# Altium schematic sheet blocking.SchDoc
size A4; CompanyName: Technische Hochschule Nürnberg Georg Simon Ohm; Address1: Fürther Straße 250; Address2: 90429 Nürnberg; Address3: GERMANY; SheetNumber: 10; SheetTotal: 21; CompanyName2: Institut ELSYS
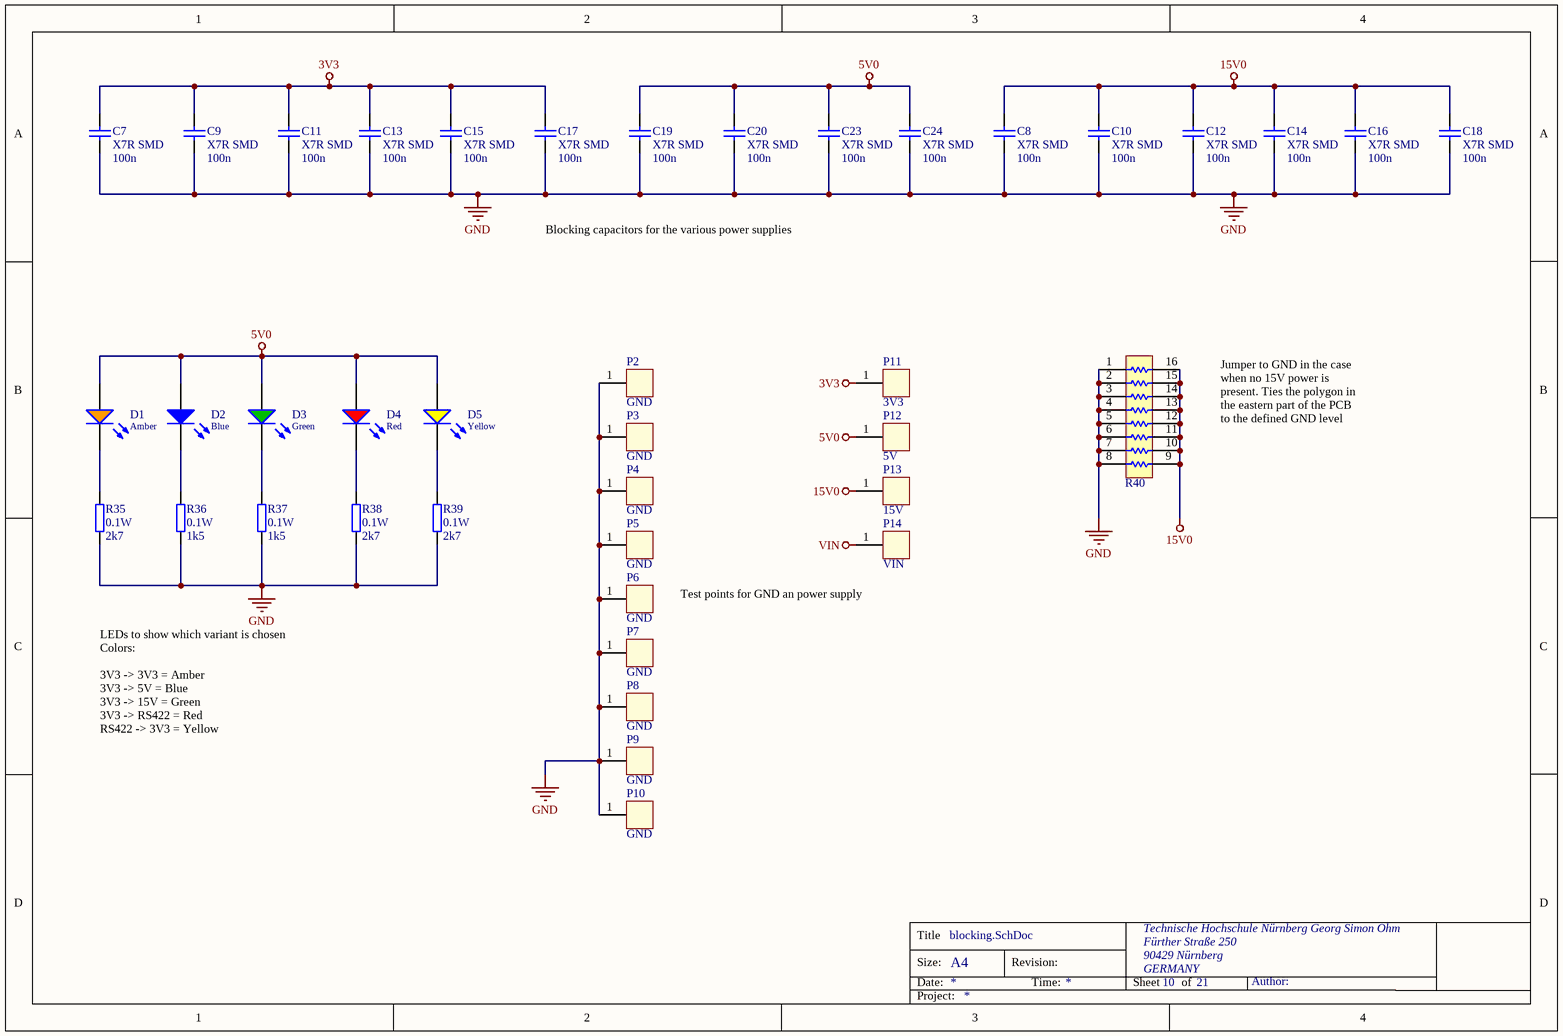
[diagram p0: blocking.SchDoc]

## Parts
C7  X7R SMD  value 100n  [CAPC3216X180X50ML20T25]
C8  X7R SMD  value 100n  [CAPC3216X180X50ML20T25]
C9  X7R SMD  value 100n  [CAPC3216X180X50ML20T25]
C10  X7R SMD  value 100n  [CAPC3216X180X50ML20T25]
C11  X7R SMD  value 100n  [CAPC3216X180X50ML20T25]
C12  X7R SMD  value 100n  [CAPC3216X180X50ML20T25]
C13  X7R SMD  value 100n  [CAPC3216X180X50ML20T25]
C14  X7R SMD  value 100n  [CAPC3216X180X50ML20T25]
C15  X7R SMD  value 100n  [CAPC3216X180X50ML20T25]
C16  X7R SMD  value 100n  [CAPC3216X180X50ML20T25]
C17  X7R SMD  value 100n  [CAPC3216X180X50ML20T25]
C18  X7R SMD  value 100n  [CAPC3216X180X50ML20T25]
C19  X7R SMD  value 100n  [CAPC3216X180X50ML20T25]
C20  X7R SMD  value 100n  [CAPC3216X180X50ML20T25]
C23  X7R SMD  value 100n  [CAPC3216X180X50ML20T25]
C24  X7R SMD  value 100n  [CAPC3216X180X50ML20T25]
D1  Amber  [WL-SMCW_0603]
D2  Blue  [WL-SMCW_0603]
D3  Green  [WL-SMCW_0603]
D4  Red  [WL-SMCW_0603]
D5  Yellow  [WL-SMCW_0603]
P2  GND  [PinHeader1]
P3  GND  [PinHeader1]
P4  GND  [PinHeader1]
P5  GND  [PinHeader1]
P6  GND  [PinHeader1]
P7  GND  [PinHeader1]
P8  GND  [PinHeader1]
P9  GND  [PinHeader1]
P10  GND  [PinHeader1]
P11  3V3  [PinHeader1]
P12  5V  [PinHeader1]
P13  15V  [PinHeader1]
P14  VIN  [PinHeader1]
R35  0.1W  value 2k7  [RESC1608X55X30NL15T15]
R36  0.1W  value 1k5  [RESC1608X55X30NL15T15]
R37  0.1W  value 1k5  [RESC1608X55X30NL15T15]
R38  0.1W  value 2k7  [RESC1608X55X30NL15T15]
R39  0.1W  value 2k7  [RESC1608X55X30NL15T15]
R40  0.063W  [RESCAXE-50P380X160X45-16N]  (value not drawn)

## Nets
3V3: C7.2 C9.2 C11.2 C13.2 C15.2 C17.2 P11.1
5V0: C19.2 C20.2 C23.2 C24.2 D1.2(A) D2.2(A) D3.2(A) D4.2(A) D5.2(A) P12.1
15V0: C8.2 C10.2 C12.2 C14.2 C16.2 C18.2 P13.1 R40.9 R40.10 R40.11 R40.12 R40.13 R40.14 R40.15 R40.16
GND: C7.1 C8.1 C9.1 C10.1 C11.1 C12.1 C13.1 C14.1 C15.1 C16.1 C17.1 C18.1 C19.1 C20.1 C23.1 C24.1 P2.1 P3.1 P4.1 P5.1 P6.1 P7.1 P8.1 P9.1 P10.1 R35.2 R36.2 R37.2 R38.2 R39.2 R40.1 R40.2 R40.3 R40.4 R40.5 R40.6 R40.7 R40.8
VIN: P14.1
NetD1_1: D1.1(K) R35.1
NetD2_1: D2.1(K) R36.1
NetD3_1: D3.1(K) R37.1
NetD4_1: D4.1(K) R38.1
NetD5_1: D5.1(K) R39.1

## Notes on the sheet
- Blocking capacitors for the various power supplies
- Jumper to GND in the case when no 15V power is present. Ties the polygon in the eastern part of the PCB to the defined GND level
- Test points for GND an power supply
- LEDs to show which variant is chosen
  Colors:
  3V3 -> 3V3 = Amber
  3V3 -> 5V = Blue
  3V3 -> 15V = Green
  3V3 -> RS422 = Red
  RS422 -> 3V3 = Yellow
- Title
- Size:
- Date:
- A4
- Revision:
- Time:
- Sheet
- of
- Author:
- Project:

## Library data of the parts
C7-C20 C23 C24 = C_X7R_MEDIUM: Standard X7R SMD capacitor. This kind of dielectricum should be used for decoupling applications. Bigger capacity is available but not for the given voltage rating.; Manufacturer1: KEMET; MPN1: C<pkg[inch]><2d cap [pf] + #zeros><ToleranceSym><VoltageSym>RACTU; Parameter1: 5; Parameter1Desc: Voltage Symbol; Parameter2: J; Parameter2Desc: Tolerance Symbol; MaxVoltage: 50; MaxCap: 1u; MinCap: 10p; Created: 2019-12-08_Thilo_Wendt; Supplier1: https://de.farnell.com/w/c/passive-bauelemente/kondensatoren/keramikkondensatoren/keramik-vielschichtkondensatoren-mlcc-smd?brand=kemet&kapazitatstoleranz=posneg-10pc&dielektrikum=x7r; Package: CAPC3216X180X50ML20T25; HelpURL: https://content.kemet.com/datasheets/KEM_C1002_X7R_SMD.pdf; Parameter3: *; Parameter3Desc: *; ComponentLink1Description: Datasheet; ComponentLink1URL: https://content.kemet.com/datasheets/KEM_C1002_X7R_SMD.pdf
D1 = LED_Amber: WL-SMCW SMD Mono-color Chip LED Waterclear, size 0603, Red, 2 V, 140°; MPN1: 150060AS75000; Forward Voltage: 2 V; Luminous Intensity: 250 mcd; Peak Wavelength: 610nm; Dominant Wavelength: 605nm; MF1: Wuerth Elektronik; Value: 150060AS75000; Published Date: Sep. 2017; ComponentLink1Description: Manufacturer; ComponentLink1URL: http://www.we-online.de; ComponentLink2Description: Datasheet; ComponentLink2URL: http://katalog.we-online.com/led/datasheet/150060AS75000.pdf; Size: 0603; Viewing Angle: 140°; Package: 0603; Created: 2020-01-07_Thilo_Wendt; Supplier 1: Digi-Key; Supplier Part Number 1: 732-150060AS75000CT-ND; Emitting Color: Amber
D2 = LED_Blue: WL-SMCW SMD Mono-color Chip LED Waterclear, size 0603, Blue, 3.2 V, 140°; MPN: 150060BS75000; Forward Voltage: 3.2 V; Luminous Intensity: 145 mcd; Peak Wavelength: 465 nm; Dominant Wavelength: 470 nm; MF: Wuerth Elektronik; Value: 150060BS75000; Published Date: Sep. 2017; ComponentLink1Description: Manufacturer; ComponentLink1URL: http://www.we-online.de; ComponentLink2Description: Datasheet; ComponentLink2URL: http://katalog.we-online.com/led/datasheet/150060BS75000.pdf; Size: 0603; Viewing Angle: 140°; Package: 0603; Created: 2018_09_06_AGeiger; Supplier 1: Farnell; Supplier Part Number 1: 2322069; Supplier 2: Mouser; Supplier Part Number 2: 710-150060BS75000; Supplier 3: Digi-Key; Supplier Part Number 3: 732-4966-1-ND; Emitting Color: Blue
D3 = LED_Green: WL-SMCW SMD Mono-color Chip LED Waterclear, size 0603, Green, 3.2 V, 140°; MPN: 150060GS75000; Forward Voltage: 3.2 V; Luminous Intensity: 430 mcd; Peak Wavelength: 515 nm; Dominant Wavelength: 520 nm; MF: Wuerth Elektronik; Value: 150060GS75000; Published Date: Sep. 2017; ComponentLink1Description: Manufacturer; ComponentLink1URL: http://www.we-online.de; ComponentLink2Description: Datasheet; ComponentLink2URL: http://katalog.we-online.com/led/datasheet/150060GS75000.pdf; Size: 0603; Viewing Angle: 140°; Package: 0603; Created: 2018_09_06_AGeiger; Supplier 1: Farnell; Supplier Part Number 1: 2322070; Supplier 2: Mouser; Supplier Part Number 2: 710-150060GS75000; Supplier 3: Digi-Key; Supplier Part Number 3: 732-4971-1-ND; Emitting Color: Green
D4 = LED_Red: WL-SMCW SMD Mono-color Chip LED Waterclear, size 0603, Red, 2 V, 140°; MPN: 150060RS75000; Forward Voltage: 2 V; Luminous Intensity: 250 mcd; Peak Wavelength: 630 nm; Dominant Wavelength: 625 nm; MF: Wuerth Elektronik; Value: 150060RS75000; Published Date: Sep. 2017; ComponentLink1Description: Manufacturer; ComponentLink1URL: http://www.we-online.de; ComponentLink2Description: Datasheet; ComponentLink2URL: http://katalog.we-online.com/led/datasheet/150060RS75000.pdf; Size: 0603; Viewing Angle: 140°; Package: 0603; Created: 2018_09_06_AGeiger; Supplier 1: Farnell; Supplier Part Number 1: 2322071; Supplier 2: Mouser; Supplier Part Number 2: 710-150060RS75000; Supplier 3: Digi-Key; Supplier Part Number 3: 732-4978-1-ND; Emitting Color: Red
D5 = LED_Yellow: WL-SMCW SMD Mono-color Chip LED Waterclear, size 0603, Red, 2 V, 140°; MPN1: 150060YS75000; Forward Voltage: 2 V; Luminous Intensity: 250 mcd; Peak Wavelength: 595; Dominant Wavelength: 590; MF1: Wuerth Elektronik; Value: 150060YS75000; Published Date: Sep. 2017; ComponentLink1Description: Manufacturer; ComponentLink1URL: http://www.we-online.de; ComponentLink2Description: Datasheet; ComponentLink2URL: http://katalog.we-online.com/led/datasheet/150060YS75000.pdf; Size: 0603; Viewing Angle: 140°; Package: 0603; Created: 2020-01-07_Thilo_Wendt; Supplier 1: Digi-Key; Supplier 2: Digi-Key; Supplier 3: Digi-Key; Supplier Part Number 1: 732-5000-1-ND; Supplier Part Number 2: 732-4987-1-ND; Supplier Part Number 3: 732-4981-1-ND; Emitting Color: Yellow
P2-P14 = PinHeader1: Pin Header with 1 terminal; Created: 2020-01-08_Thilo_Wendt
  P2-P10: Net: GND
  P11: Net: 3V3
  P12: Net: 5V
  P13: Net: 15V
  P14: Net: VIN
R35-R39 = R_0.1W_SMD: Standard thick film resistor; Manufacturer1: Panasonic; MPN1: ERJU<pkg><tol><val><pkg_meth>; Parameter1: V; Parameter1Desc: Package Method; Parameter2: F; Parameter2Desc: Tolerance Symbol; MaxVoltage: 100; Created: 2019-12-08_Thilo_Wendt; Supplier1: https://de.farnell.com/w/search?qualifizierungsstandard-der-automobilindustrie=aec-q200&range=inc-in-stock&st=erju; Package: RESC1608X55X30NL15T15; HelpURL: https://www.mouser.de/datasheet/2/315/AOA0000C334-1314047.pdf; Parameter3: *; Parameter3Desc: *; ComponentLink1Description: Datasheet; ComponentLink1URL: https://www.mouser.de/datasheet/2/315/AOA0000C334-1314047.pdf
R40 = 8xR-Array_1_part: Standard thick film resistor array with 8 resistors; Manufacturer1: Panasonic; MPN1: EXB2HV<2dig_res+#zeros><tol/jumper>V; Parameter1: V; Parameter1Desc: Package Method; Parameter2: J; Parameter2Desc: Tolerance Symbol; MaxVoltage: 100; Value: 0; Created: 2020-01-03_Thilo_Wendt; Supplier1: https://de.farnell.com/w/search?range=inc-in-stock&st=exb2hv; Package: RESCAXE-50P380X160X45-16N; HelpURL: https://www.mouser.de/datasheet/2/315/AOC0000C14-1108062.pdf; Parameter3: *; Parameter3Desc: *; ComponentLink1Description: Datasheet; ComponentLink1URL: https://www.mouser.de/datasheet/2/315/AOC0000C14-1108062.pdf; ComponentLink2Description: Landpattern; ComponentLink2URL: https://industrial.panasonic.com/cdbs/www-data/pdf/AOC0000/AOC0000COL4.pdf